# Altium schematic sheet [03] - REVISION HISTORY.SchDoc: Revision History
size A3; SheetNumber: 3; SheetTotal: 6
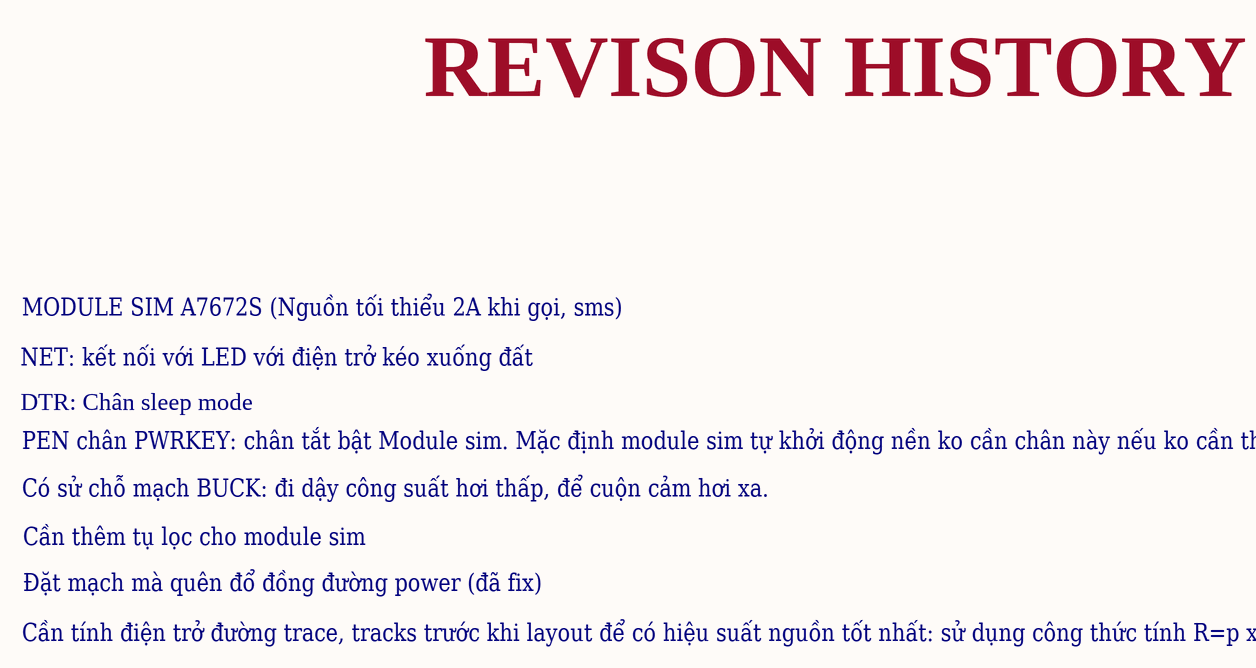
[diagram p0: [03] - REVISION HISTORY.SchDoc]

## Notes on the sheet
- REVISON HISTORY
- MODULE SIM A7672S (Nguồn tối thiểu 2A khi gọi, sms)
- NET: kết nối với LED với điện trở kéo xuống đất
- DTR: Chân sleep mode
- PEN chân PWRKEY: chân tắt bật Module sim. Mặc định module sim tự khởi động nền ko cần chân này nếu ko cần thiết
- Có sử chỗ mạch BUCK: đi dậy công suất hơi thấp, để cuộn cảm hơi xa.
- Cần thêm tụ lọc cho module sim
- Đặt mạch mà quên đổ đồng đường power (đã fix)
- Cần tính điện trở đường trace, tracks trước khi layout để có hiệu suất nguồn tốt nhất: sử dụng công thức tính R=p x L/S hoặc sử dụng công tính toán điện trở đường dây
- Title:
- Desc:
- Designed by:
- Checked by:
- Date:
- Document No:
- Revision:
- Size:
- A3
- Approved by:
- Sheet
- of